# EAGLE schematic H-API_DIST (EAGLE 9.1.3)
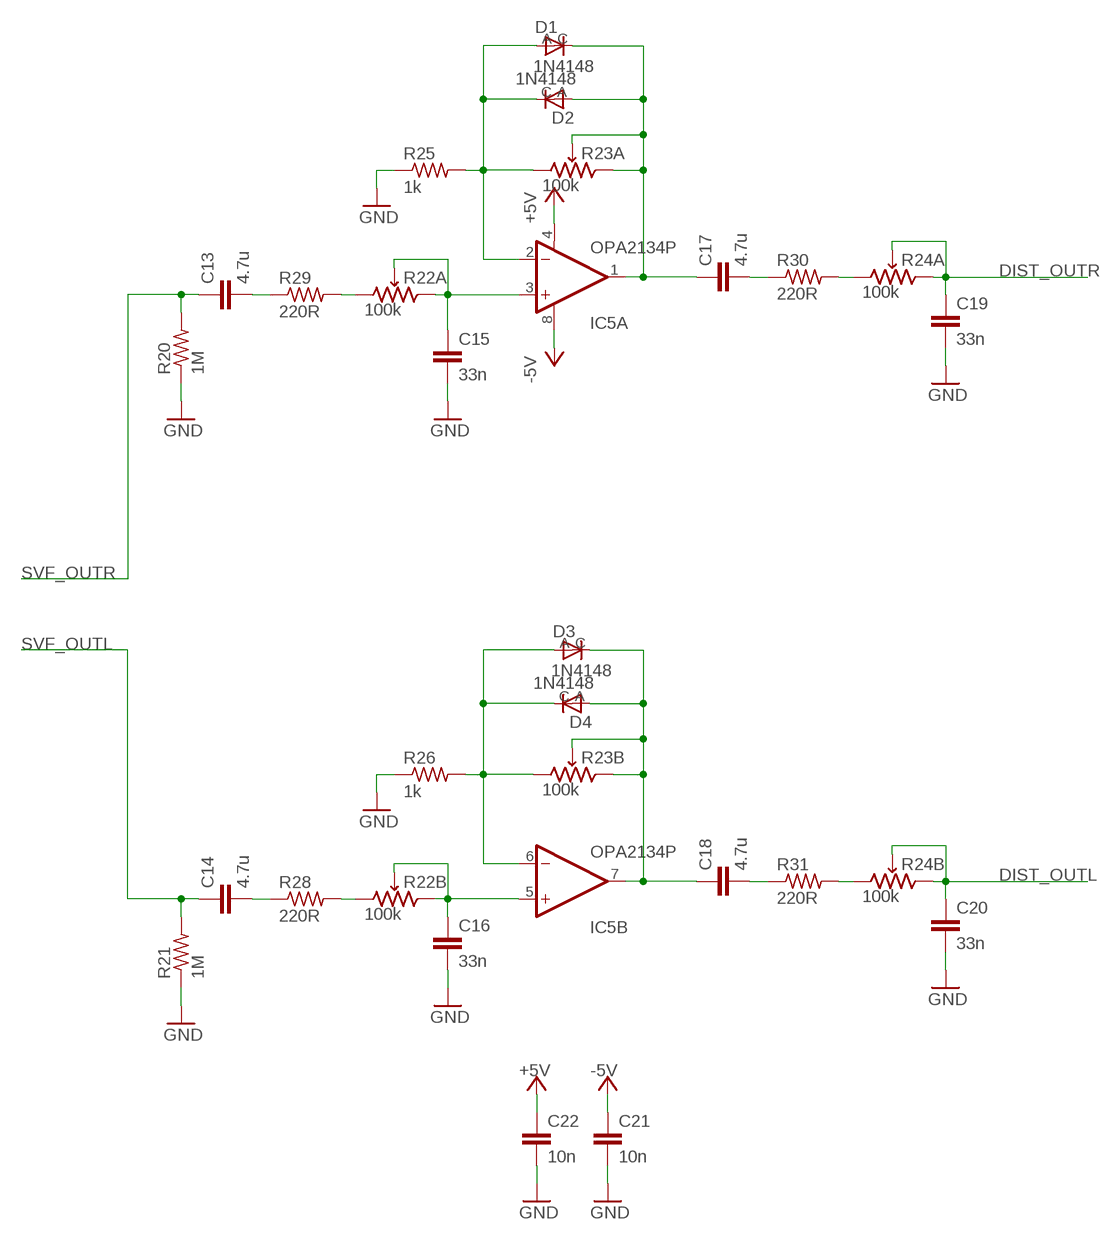
[diagram p0: schematic, sheet 1]

## Parts
C13  4.7u  C-EUC0805  [C0805]
C14  4.7u  C-EUC0805  [C0805]
C15  33n  C-EUC0805  [C0805]
C16  33n  C-EUC0805  [C0805]
C17  4.7u  C-EUC0805  [C0805]
C18  4.7u  C-EUC0805  [C0805]
C19  33n  C-EUC0805  [C0805]
C20  33n  C-EUC0805  [C0805]
C21  10n  C-EUC0805  [C0805]
C22  10n  C-EUC0805  [C0805]
D1  1N4148  [DO41-7]
D2  1N4148  [DO41-7]
D3  1N4148  [DO41-7]
D4  1N4148  [DO41-7]
IC5  OPA2134P  [DIL08]
R20  1M  R-US_VMTA55  [VMTA55]
R21  1M  R-US_VMTA55  [VMTA55]
R22  100k  PTR902-2015F-C104  [POT2-SW]
R23  100k  PTR902-2015F-C104  [POT2-SW]
R24  100k  PTR902-2015F-C104  [POT2-SW]
R25  1k  R-US_VMTA55  [VMTA55]
R26  1k  R-US_VMTA55  [VMTA55]
R28  220R  R-US_VMTA55  [VMTA55]
R29  220R  R-US_VMTA55  [VMTA55]
R30  220R  R-US_VMTA55  [VMTA55]
R31  220R  R-US_VMTA55  [VMTA55]

## Nets
+5V: C22.1 IC5.4(A:V-)
-5V: C21.1 IC5.8(A:V+)
DIST_OUTL: C20.1 R24.2E R24.2S
DIST_OUTR: C19.1 R24.1E R24.1S
GND: C15.2 C16.2 C19.2 C20.2 C21.2 C22.2 R20.1 R21.1 R25.1 R26.1
N$19: C14.2 R28.1
N$21: C13.2 R29.1
N$23: R22.1A R29.2
N$24: R22.2A R28.2
N$25: D1.A D2.C IC5.2(A:-IN) R23.1A R25.2
N$26: D3.A D4.C IC5.6(B:-IN) R23.2A R26.2
N$27: C18.1 D3.C D4.A IC5.7(B:OUT) R23.2E R23.2S
N$28: C17.1 D1.C D2.A IC5.1(A:OUT) R23.1E R23.1S
N$29: C18.2 R31.1
N$30: C16.1 IC5.5(B:+IN) R22.2E R22.2S
N$31: C17.2 R30.1
N$32: C15.1 IC5.3(A:+IN) R22.1E R22.1S
N$33: R24.1A R30.2
N$36: R24.2A R31.2
SVF_OUTL: C14.1 R21.2
SVF_OUTR: C13.1 R20.2
Unconnected: R22.3A R22.3B R23.3A R23.3B R24.3A R24.3B

## Library data of the parts
C13-C22 = rcl:C-EU: CAPACITOR, European symbol; SPICEPREFIX: C
D1-D4 = CapstoneLib:1N4148
IC5 = burr-brown:OPA2134: Operational Amplifier; MF: TEXAS INSTRUMENTS; MPN: OPA2134PA; OC_FARNELL: 1097574; OC_NEWARK: 74K3897
R20 R21 R25 R26 R28-R31 = rcl:R-US_: RESISTOR, American symbol; SPICEPREFIX: R
R22-R24 = CapstoneLib:PTR902-2015F-C104